# Altium schematic sheet FAN_IF.SchDoc
size A4; SheetNumber: 9; SheetTotal: 9
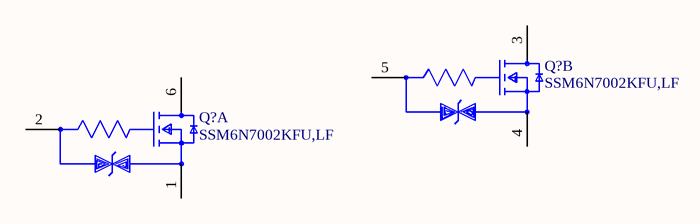
[diagram p0: FAN_IF.SchDoc]

## Parts
(Parts that share a designator on the sheet are numbered #1, #2 ... from top to bottom, then left to right.)
Q?#1  SSM6N7002KFU,LF  [FP-SSOP6-P-0_65A-MFG]  (part B of 2)
Q?#2  SSM6N7002KFU,LF  [FP-SSOP6-P-0_65A-MFG]  (part A of 2)

## Nets

Not connected (* = marked no-connect by the designer): Q?#1 3(Drain2) 4(Source2) 5(Gate2); Q?#2 1(Source1) 2(Gate1) 6(Drain1)

## Library data of the parts
Q?#1 Q?#2 = CMP-35916-000009-1: MOSFET 2N-CH 60V 0.3A; Input Capacitance: 40pF; Continuous Drain Current (ID): 300mA; Max Power Dissipation: 285mW; FET Type: 2 N-Channel; Rds On Max: 1.5R; Mount: Surface Mount; Drain to Source Voltage (Vdss): 60V; Packaging: Tape and Reel